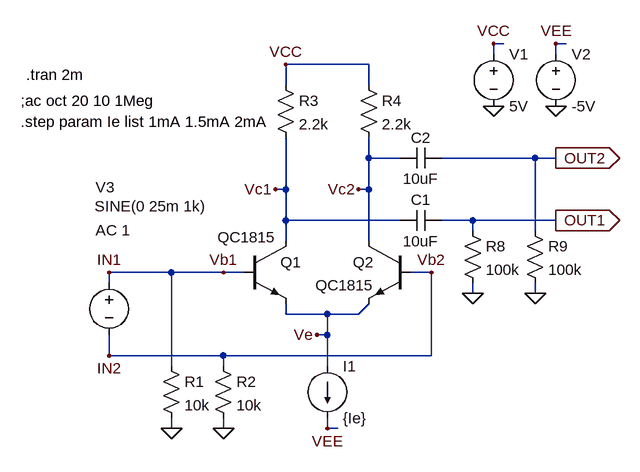
[diagram p0: schematic Diff_Amp_2SC1815 _CurrentSauce.asc]
Diff_Amp_2SC1815 _CurrentSauce.asc, the LTspice schematic file:
Version 4
SHEET 1 880 680
WIRE 512 -192 496 -192
WIRE 608 -192 592 -192
WIRE 496 -176 496 -192
WIRE 592 -176 592 -192
WIRE 304 -160 176 -160
WIRE 176 -128 176 -160
WIRE 304 -128 304 -160
WIRE 304 -16 304 -48
WIRE 352 -16 304 -16
WIRE 560 -16 416 -16
WIRE 592 -16 560 -16
WIRE 176 32 176 -48
WIRE 176 32 160 32
WIRE 304 32 304 -16
WIRE 304 32 288 32
WIRE 176 80 176 32
WIRE 352 80 176 80
WIRE 464 80 416 80
WIRE 592 80 464 80
WIRE 464 96 464 80
WIRE 560 96 560 -16
WIRE 176 112 176 80
WIRE 304 112 304 32
WIRE 0 160 -96 160
WIRE 80 160 0 160
WIRE 112 160 80 160
WIRE 400 160 368 160
WIRE -96 176 -96 160
WIRE 464 192 464 176
WIRE 560 192 560 176
WIRE 176 224 176 208
WIRE 240 224 176 224
WIRE 288 224 304 208
WIRE 288 224 240 224
WIRE 240 256 240 224
WIRE 240 256 224 256
WIRE -96 288 -96 256
WIRE 80 288 -96 288
WIRE 400 288 400 160
WIRE 400 288 80 288
WIRE 0 304 0 160
WIRE 80 304 80 288
WIRE 240 304 240 256
WIRE 0 400 0 384
WIRE 80 400 80 384
WIRE 240 400 240 384
WIRE 256 400 240 400
FLAG 0 400 0
FLAG 80 400 0
FLAG 176 -160 VCC
FLAG 464 192 0
FLAG 560 192 0
FLAG 592 80 OUT1
IOPIN 592 80 Out
FLAG 592 -16 OUT2
IOPIN 592 -16 Out
FLAG 496 -96 0
FLAG 592 -96 0
FLAG 496 -192 VCC
FLAG 592 -192 VEE
FLAG -96 160 IN1
FLAG -96 288 IN2
FLAG 160 32 Vc1
FLAG 288 32 Vc2
FLAG 224 256 Ve
FLAG 80 160 Vb1
FLAG 400 160 Vb2
FLAG 240 400 VEE
SYMBOL npn 112 112 R0
WINDOW 3 -41 -6 Left 2
SYMATTR Value QC1815
SYMATTR InstName Q1
SYMBOL npn 368 112 M0
SYMATTR InstName Q2
SYMATTR Value QC1815
SYMBOL res -16 288 R0
SYMATTR InstName R1
SYMATTR Value 10k
SYMBOL res 64 288 R0
SYMATTR InstName R2
SYMATTR Value 10k
SYMBOL res 160 -144 R0
SYMATTR InstName R3
SYMATTR Value 2.2k
SYMBOL res 288 -144 R0
SYMATTR InstName R4
SYMATTR Value 2.2k
SYMBOL cap 416 64 R90
WINDOW 0 0 32 VBottom 2
WINDOW 3 32 32 VTop 2
SYMATTR InstName C1
SYMATTR Value 10uF
SYMBOL cap 416 -32 R90
WINDOW 0 0 32 VBottom 2
WINDOW 3 32 32 VTop 2
SYMATTR InstName C2
SYMATTR Value 10uF
SYMBOL res 448 80 R0
SYMATTR InstName R8
SYMATTR Value 100k
SYMBOL res 544 80 R0
SYMATTR InstName R9
SYMATTR Value 100k
SYMBOL voltage 496 -192 R0
WINDOW 123 0 0 Left 2
WINDOW 39 0 0 Left 2
SYMATTR InstName V1
SYMATTR Value 5V
SYMBOL voltage 592 -192 R0
WINDOW 123 0 0 Left 2
WINDOW 39 0 0 Left 2
SYMATTR InstName V2
SYMATTR Value -5V
SYMBOL voltage -96 160 R0
WINDOW 0 -21 -131 Left 2
WINDOW 3 -22 -102 Left 2
WINDOW 123 -21 -65 Left 2
WINDOW 39 0 0 Left 2
SYMATTR InstName V3
SYMATTR Value SINE(0 25m 1k)
SYMATTR Value2 AC 1
SYMBOL current 240 304 R0
WINDOW 123 0 0 Left 2
WINDOW 39 0 0 Left 2
SYMATTR InstName I1
SYMATTR Value {Ie}
TEXT -224 -144 Left 2 !.tran 2m
TEXT -232 -104 Left 2 !;ac oct 20 10 1Meg
TEXT -232 -72 Left 2 !.step param Ie list 1mA 1.5mA 2mA

The netlist it stands for:
* Diff_Amp_2SC1815 _CurrentSauce.asc
Q1 Vc1 Vb1 Ve 0 QC1815
Q2 Vc2 Vb2 Ve 0 QC1815
R1 Vb1 0 10k
R2 Vb2 0 10k
R3 VCC Vc1 2.2k
R4 VCC Vc2 2.2k
C1 OUT1 Vc1 10uF
C2 OUT2 Vc2 10uF
R8 OUT1 0 100k
R9 OUT2 0 100k
V1 VCC 0 5V
V2 VEE 0 -5V
V3 Vb1 Vb2 SINE(0 25m 1k) AC 1
I1 Ve VEE {Ie}
.model NPN NPN
.model PNP PNP
.lib standard.bjt
.tran 2m
;ac oct 20 10 1Meg
.step param Ie list 1mA 1.5mA 2mA
.backanno
.end